# EAGLE schematic Small Antenna V2.1 (EAGLE 8.2.2)
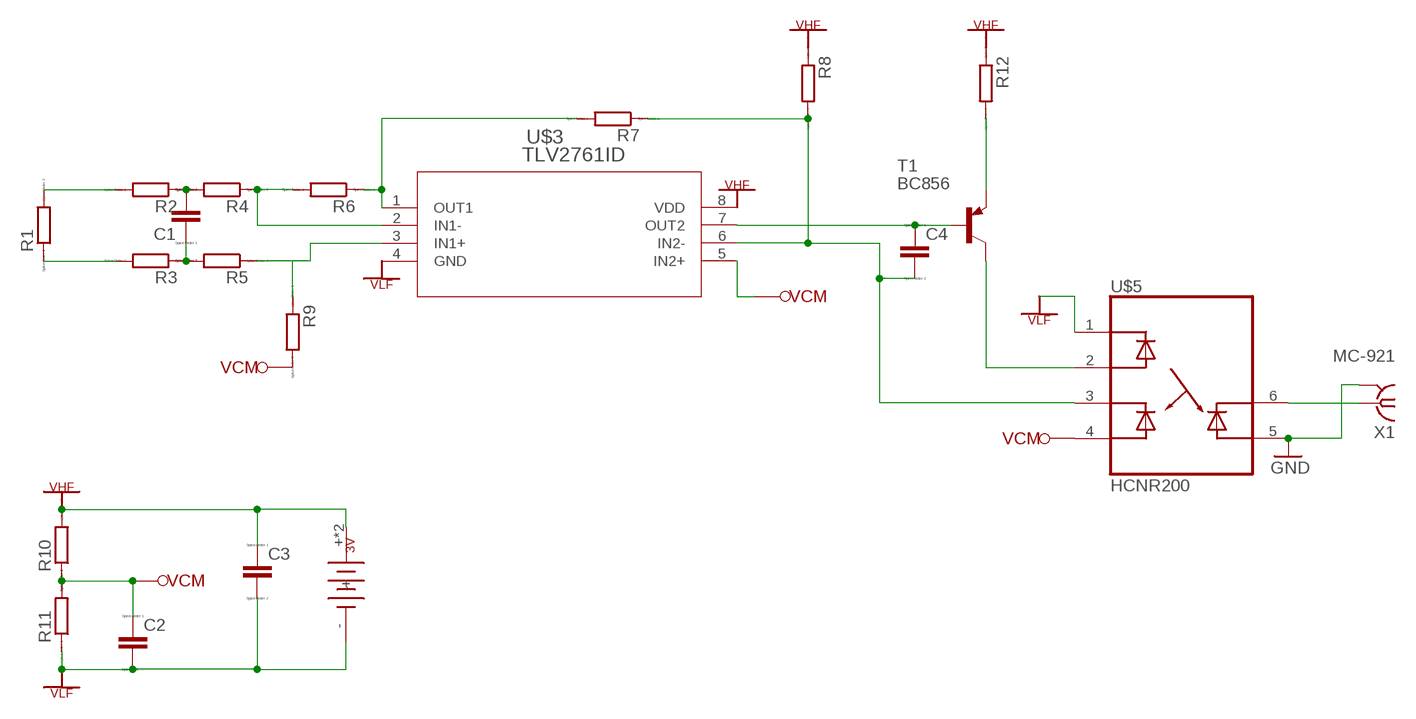
[diagram p0: schematic, sheet 1]

## Parts
C1  CC0603  [C0603]
C2  CC0603  [C0603]
C3  CC0603  [C0603]
C4  CC0603  [C0603]
R1  RR0402  [R0402]
R2  RR0402  [R0402]
R3  RR0402  [R0402]
R4  RR0402  [R0402]
R5  RR0402  [R0402]
R6  RR0402  [R0402]
R7  RR0402  [R0402]
R8  RR0402  [R0402]
R9  RR0402  [R0402]
R10  RR0402  [R0402]
R11  RR0402  [R0402]
R12  RR0402  [R0402]
T1  BC856  [SOT23]
U$3  TLV2761ID  [D8]
U$5  HCNR200  [SOIC254P1030X390-8N]
U$12  CR1025BATTERYHOLDER  [BATTERYHOLDDER]
X1  MC-921  [MC-921]

## Nets
GND: U$5.5(A3) X1.2@1(GND) X1.2@2(GND)
N$1: R1.2 R2.2
N$2: R1.1 R3.2
N$3: C1.2 R2.1 R4.2
N$4: C1.1 R3.1 R5.2
N$5: R4.1 R6.2 U$3.2(IN1-)
N$6: R5.1 U$3.3(IN1+)
N$7: R6.1 R7.2 U$3.1(OUT1)
N$8: C4.2 R7.1 R8.2 U$3.6(IN2-) U$5.3(C2)
N$9: R9.1
N$10: R12.2 T1.2(E)
N$11: C4.1 T1.1(B) U$3.7(OUT2)
N$12: T1.3(C) U$5.2(A1)
N$13: U$5.6(C3) X1.1
VCM: C2.1 R9.2 R10.1 R11.2 U$3.5(IN2+) U$5.4(A2)
VHF: C3.1 R8.1 R10.2 R12.1 U$3.8(VDD) U$12.+ U$12.+2(+)
VHL: U$3.4(GND) U$5.1(C1) ; supply symbol labelled VLF
VLF: C2.2 C3.2 R11.1 U$12.-

## Library data of the parts
C1-C4 = eagle-ltspice:C: CAPACITOR, European symbol; SPICEMODEL: NONE; SPICEPREFIX: C
R1-R12 = eagle-ltspice:R: RESISTOR, European symbol; SPICEMODEL: NONE; SPICEPREFIX: R
T1 = nxp_60_1_1:BC856: PNP general purpose transistors AAL Eindhoven MK
U$3 = TLV2761-SOIC8:TLV2761ID; MANUFACTURER_PART_NUMBER: tlv2761_d_8; VENDOR: Texas Instruments
U$5 = IL300:HCNR200
U$12 = MyParts:CR1025BATTERYHOLDER
X1 = con-coax:MC-921: COAX. MICROWAVE CONNECTOR O/D diam 2.1 Source: www.tycoelectronics.com .. Electronics .. ENG_CD_1775146_A2.pdf; OC_FARNELL: unknown; OC_NEWARK: unknown